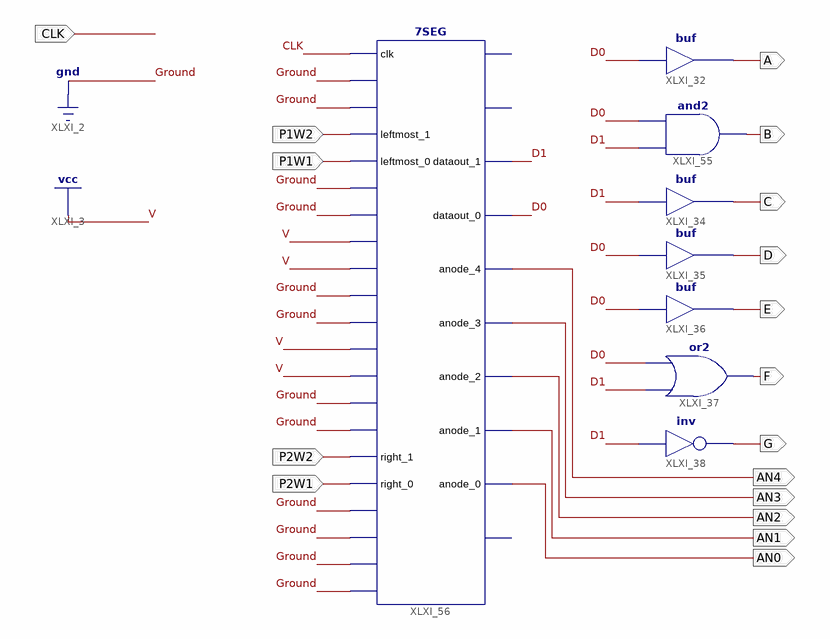
[diagram p0: schematic sheet 1]
// Xilinx ISE schematic Display.sch (spartan6) as structural Verilog: 8 symbols, 17 ports
module Display (
  input  CLK,
  input  P1W2,
  input  P1W1,
  input  P2W2,
  input  P2W1,
  output AN0,
  output AN1,
  output AN2,
  output AN3,
  output AN4,
  output A,
  output C,
  output D,
  output E,
  output F,
  output G,
  output B
);

  wire D0, D1;

  buf XLXI_32 (A, D0);
  buf XLXI_34 (C, D1);
  buf XLXI_35 (D, D0);
  buf XLXI_36 (E, D0);
  or XLXI_37 (F, D1, D0);
  and XLXI_55 (B, D1, D0);
  not XLXI_38 (G, D1);
  \7SEG  XLXI_56 (
    .clk(CLK), .leftmost_3(1'b0), .leftmost_2(1'b0), .leftmost_1(P1W2), .leftmost_0(P1W1),
    .left_center_3(1'b0), .left_center_2(1'b0), .left_center_1(1'b1), .left_center_0(1'b1),
    .right_center_3(1'b0), .right_center_2(1'b0), .right_center_1(1'b1), .right_center_0(1'b1),
    .right_3(1'b0), .right_2(1'b0), .right_1(P2W2), .right_0(P2W1), .leftmost_dp(1'b0),
    .left_center_dp(1'b0), .right_center_dp(1'b0), .rightmost_dp(1'b0), .dataout_1(D1), .dataout_0(D0),
    .anode_4(AN4), .anode_3(AN3), .anode_2(AN2), .anode_1(AN1), .anode_0(AN0));  // open: dataout_3, dataout_2, dp
endmodule
